# Altium schematic sheet TVR_Rev2_Ignition.SchDoc
size A4; SheetNumber: 4; SheetTotal: 4
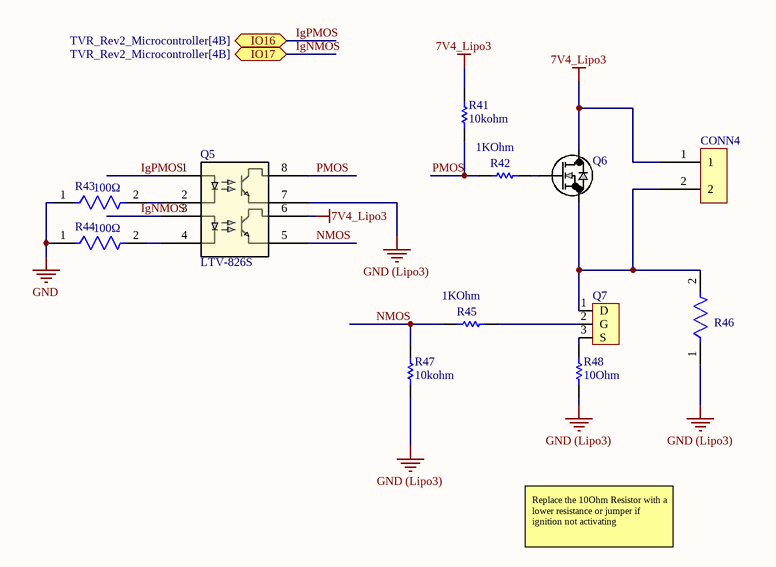
[diagram p0: TVR_Rev2_Ignition.SchDoc]

## Parts
CONN4  691137710002  [2PIN_TERMINAL]  (value not drawn)
Q5  LTV-826S  [LTV-826S_LTO]
Q6  AOD4189  [TO-252_D-PAK_AOS]  (value not drawn)
Q7  DMNH6021SK3Q-13  [TO252(DPAK)]  (value not drawn)
R41  Resistance: 10kohm  [RESC2013X60X35ML10T20]  (hidden comment: RC0805JR-0710KL)
R42  Resistance: 1KOhm  [RESC2013X60X35ML10T20]  (hidden comment: RC0805FR-071KL)
R43  Resistance: 100Ω  [FP-RC0603-0_55-MFG]  (hidden comment: RC0603FR-07100RL)
R44  Resistance: 100Ω  [FP-RC0603-0_55-MFG]  (hidden comment: RC0603FR-07100RL)
R45  Resistance: 1KOhm  [RESC2013X60X35ML10T20]  (hidden comment: RC0805FR-071KL)
R46  RC0805FR-07100KL  [FP-RC0805-0_6-IPC_C]  (value not drawn)
R47  Resistance: 10kohm  [RESC2013X60X35ML10T20]  (hidden comment: RC0805JR-0710KL)
R48  Resistance: 10Ohm  [RESC2013X60X35ML10T20]  (hidden comment: RC0805FR-0710RL)

## Ports
IO16 (bidir, see TVR_Rev2_Microcontroller[4B]), IO17 (bidir, see TVR_Rev2_Microcontroller[4B])

## Nets
7V4_Lipo3: CONN4.1 Q5.6 Q6.3(D) R41.2
GND: R43.1 R44.1
GND (Lipo3): Q5.7 R46.1 R47.2 R48.1
IgNMOS: Q5.3 ; port IO17
IgPMOS: Q5.1 ; port IO16
NMOS: Q5.5 R45.1 R47.1
PMOS: Q5.8 R41.1 R42.1
NetCONN4_2: CONN4.2 Q6.2(S) Q7.1(D) R46.2
NetQ5_2: Q5.2 R43.2
NetQ5_4: Q5.4 R44.2
NetQ6_1: Q6.1(G) R42.2
NetQ7_2: Q7.2(G) R45.2
NetQ7_3: Q7.3(S) R48.2

## Notes on the sheet
- Replace the 10Ohm Resistor with a lower resistance or jumper if ignition not activating

## Library data of the parts
CONN4 = 2PIN_TERMINAL
Q5 = LTV-826S: No Description Available; Mfr_Name: LITE-ON; RefDes: RefDes; Type: Type
Q6 = AOD4189: P Channel MOSFET 40V 40A; Mfr_Name: Alpha and Omega Semiconductor
Q7 = DMNH6021SK3Q-13: N-Channel MOSFET, 60V 50A SMD with drain pad
R41 R47 = CMP-2000-05025-1: Chip Resistor, 10 KOhm, +/- 5%, 0.125 W, -55 to 155 degC, 0805 (2012 Metric), RoHS, Tape and Reel; Manufacturer: Yageo; Resistor Element Type: ThickFilm; Voltage Rating: 150V; Product Range: RCSeries; SVHC: ToBeAdvised; Resistor Case Style: 0805[2012Metric]; Temperature Coefficient: ±100ppm/degC; Power Rating: 250mW; Automotive Qualification Standard: -; Datasheet Version: REV. 2, 09/2004; Packaging: CutTape; Resistance Tolerance: ±5%; MSL: MSL1-Unlimited; Manufacturer URL: http://www.yageo.com/; Datasheet URL: http://www.yageo.ru/pdf/RC0805.pdf; Package Description: 2-Pin Surface Mounted Device, Body 2 x 1.25 mm; Package Reference: 805
R42 R45 = CMP-2100-03671-1: Chip Resistor, 1 KOhm, +/- 1%, 125 mW, -55 to 155 degC, 0805 (2012 Metric), RoHS, Tape and Reel; Manufacturer: Yageo; Temperature Coefficient: 100ppm/degreesC; Voltage Rating (DC): 150V; Max Power Dissipation: 125mW; Number of Pins: 2; Number of Terminations: 2; Datasheet URL: http://www.yageo.com/NewPortal/yageodocoutput?fileName=/pdf/R-Chip/PYu-RC_Group_51_RoHS_L_5.pdf; Length: 0.079inch; Package Description: 2-Pin Surface Mounted Device, Body 2 x 1.25 mm; Depth: 1.25mm; Height: 0.024inch; Military Standard: Not; Case/Package: 0805; Package Reference: 0805; RoHSCompliant: true; Lead Free: LeadFree; Packaging: TapeandReel; Package Quantity: 1; Datasheet Version: Rev. 5, 10/2016; Tolerance: 1%; Min Operating Temperature: -55degC; Voltage Rating: 150V; Composition: ThickFilm; Case Code (Imperial): 0805; Power Rating: 125mW; Width: 0.049inch; Case Code (Metric): 2012; Manufacturer URL: http://www.yageo.com/; Max Operating Temperature: 155degC; REACH SVHC: Unknown; Termination: SMD/SMT
R43 R44 = CMP-2100-03663-2: NexarPartId: 55402879; Voltage Rating: 50V; Power Rating: 100mW; Tolerance: 1%; Temperature Coefficient: 100ppm/°C; Case/Package: 0603; Military Standard: Not; REACH SVHC: Unknown; Case Code (Metric): 0603; Max Operating Temperature: 155°C; Schedule B: 8533210045, 8533210045; Height: 450µm; Length: 1.6mm; Lead Free: Lead Free; Packaging: Tape & Reel; Case Code (Imperial): 0603; Composition: Thick Film; Min Operating Temperature: -55°C; Voltage Rating (DC): 50V; RoHS: Compliant; Depth: 800µm; Number of Pins: 2; Termination: SMD/SMT; Width: 800µm
R46 = CMP-2100-03668-5: RES 100K OHM 1% 1/8W 0805; Power Rating: 125mW; Temperature Coefficient: 100ppm/°C; Voltage Rating (DC): 150V; Resistance: 100kR; Package Quantity: 1; Case/Package: 0805; Lead Pitch: 0.4mm; Case Code (Imperial): 0805; Construction: Rectangular; Number of Terminations: 2; RoHS Compliant: Yes; Max Power Dissipation: 125mW; Tolerance: 1%; Max Operating Temperature: 155°C; Resistance Tolerance: 1%; Lead Free: Lead Free; Packaging: Tape and Reel; Resistor Type: Thick Film; Min Operating Temperature: -55°C; Case Code (Metric): 2012; Series: RC; Technology: THICK FILM; Voltage Rating: 150V; Termination: SMD/SMT; Width: 0.049inch; Number of Pins: 2; Features: Moisture Resistant; Military Standard: Not; Length: 0.079inch; Depth: 1.25mm; Size Code: 0805; Height: 0.024inch
R48 = CMP-2100-03670-1: Chip Resistor, 10 Ohm, +/- 1%, 0.125 W, -55 to 155 degC, 0805 (2012 Metric), RoHS, Tape and Reel; Manufacturer: Yageo; Power Rating: 125mW; Voltage Rating: 150V; Temperature Coefficient: 200ppm/degreesC; Number of Pins: 2; REACH SVHC: NoSVHC; Datasheet Version: Rev. 5, 10/2016; Max Operating Temperature: 155degC; Manufacturer URL: http://www.yageo.com/; Case Code (Imperial): 0805; Package Description: 2-Pin Surface Mounted Device, Body 2 x 1.25 mm; Case Code (Metric): 2012; Length: 2mm; RoHSCompliant: true; Max Power Dissipation: 125mW; Depth: 1.25mm; Packaging: TapeandReel; Height: 0.5mm; Package Reference: 0805; Package Quantity: 1; Tolerance: 1%; Termination: SMD/SMT; Min Operating Temperature: -55degC; Lead Free: LeadFree; Width: 1.25mm; Voltage Rating (DC): 150V; Datasheet URL: http://www.yageo.com/NewPortal/yageodocoutput?fileName=/pdf/R-Chip/PYu-RC_Group_51_RoHS_L_5.pdf; Composition: ThickFilm; Number of Terminations: 2; Case/Package: 0805